# EAGLE design modul_atmega32 (EAGLE 7.7.0)
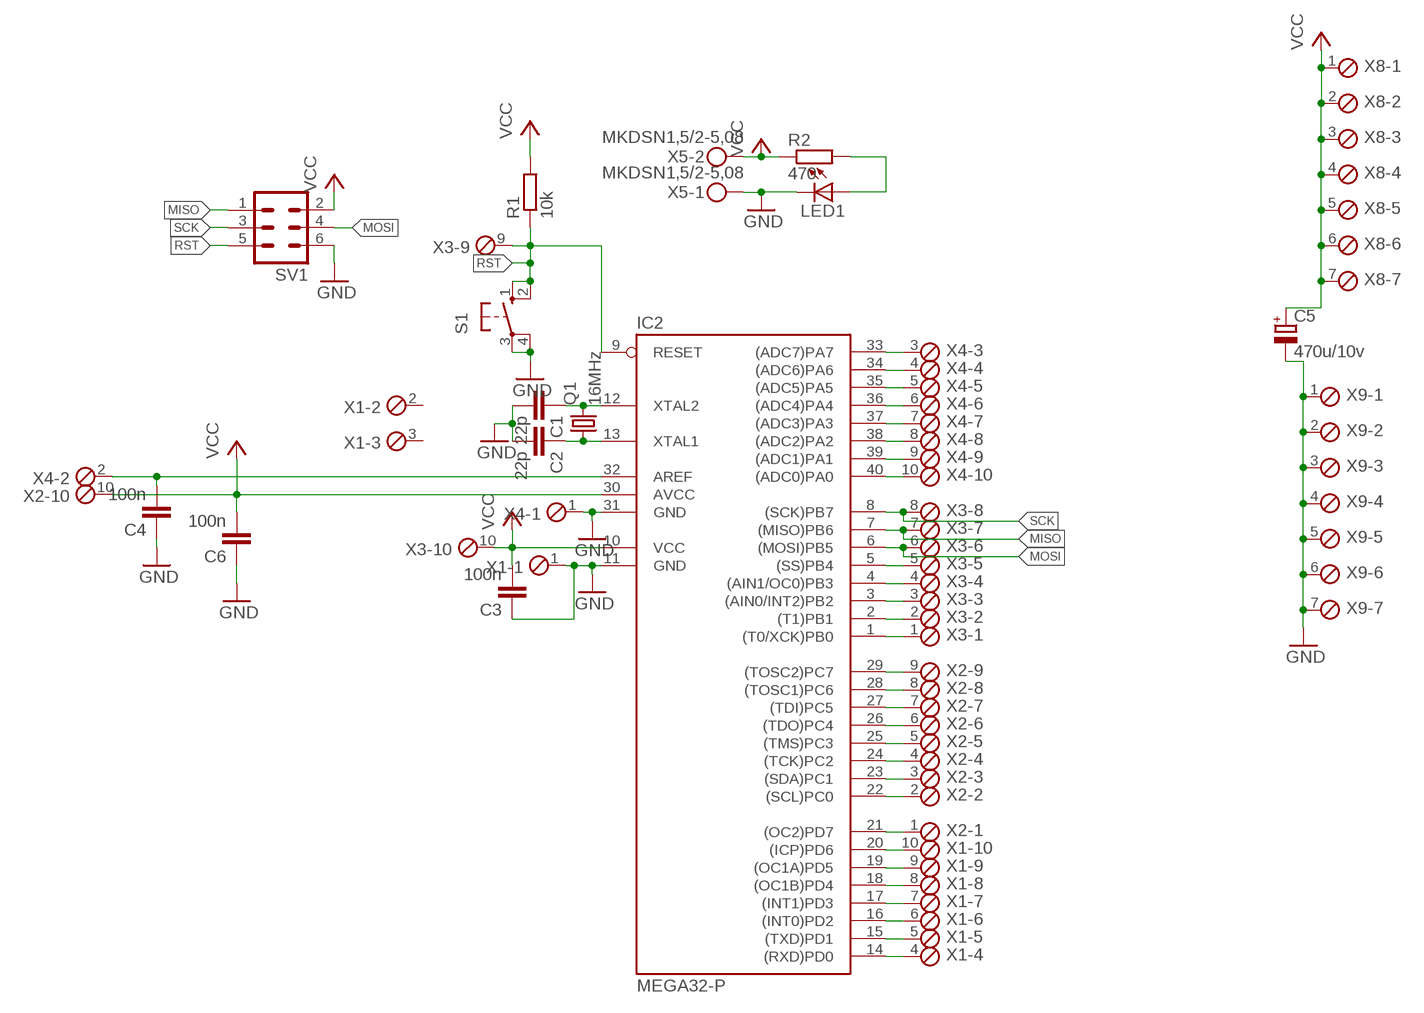
[diagram p0: schematic, sheet 1]

## Parts
C1  22p  C-EUC0805K  [C0805K]
C2  22p  C-EUC0805K  [C0805K]
C3  100n  C-EUC1206  [C1206]
C4  100n  C-EUC1206  [C1206]
C5  470u/10v  CPOL-EUE5-8.5  [E5-8,5]
C6  100n  C-EUC1206  [C1206]
IC2  MEGA32-P  [DIL40]
LED1  LED3MM  [LED3MM]
Q1  16MHz  CRYSTALHC49UP  [HC49UP]
R1  10k  R-EU_R1206  [R1206]
R2  470  R-EU_R1206  [R1206]
S1  10-XX  [B3F-10XX]
SV1  MA03-2  [MA03-2]
X1  MPT10  [10POL254]
X2  MPT10  [10POL254]
X3  MPT10  [10POL254]
X4  MPT10  [10POL254]
X5  MKDSN1,5/2-5,08  [MKDSN1,5/2-5,08]
X8  MPT7  [7POL254]
X9  MPT7  [7POL254]

## Nets
AREF: C4.2 IC2.32(AREF) X4.2
GND: C1.2 C2.2 C3.1 C4.1 C5.- C6.1 IC2.11(GND) IC2.31(GND) LED1.K(C) S1.3(P) S1.4(P1) SV1.6 X1.1 X4.1 X5.1 X9.1 X9.2 X9.3 X9.4 X9.5 X9.6 X9.7
MISO: IC2.7((MISO)PB6) SV1.1 X3.7
MOSI: IC2.6((MOSI)PB5) SV1.4 X3.6
N$1: IC2.21((OC2)PD7) X2.1
N$2: LED1.A R2.2
N$4: IC2.5((SS)PB4) X3.5
N$5: IC2.4((AIN1/OC0)PB3) X3.4
N$6: IC2.3((AIN0/INT2)PB2) X3.3
N$7: IC2.2((T1)PB1) X3.2
N$8: IC2.1((T0/XCK)PB0) X3.1
N$11: IC2.14((RXD)PD0) X1.4
N$12: IC2.15((TXD)PD1) X1.5
N$13: IC2.16((INT0)PD2) X1.6
N$14: IC2.17((INT1)PD3) X1.7
N$15: IC2.18((OC1B)PD4) X1.8
N$16: IC2.19((OC1A)PD5) X1.9
N$17: IC2.20((ICP)PD6) X1.10
N$19: C2.1 IC2.13(XTAL1) Q1.1
N$20: C1.1 IC2.12(XTAL2) Q1.2
N$22: IC2.29((TOSC2)PC7) X2.9
N$23: IC2.28((TOSC1)PC6) X2.8
N$24: IC2.27((TDI)PC5) X2.7
N$25: IC2.26((TDO)PC4) X2.6
N$26: IC2.25((TMS)PC3) X2.5
N$27: IC2.24((TCK)PC2) X2.4
N$28: IC2.23((SDA)PC1) X2.3
N$29: IC2.22((SCL)PC0) X2.2
N$32: IC2.33((ADC7)PA7) X4.3
N$33: IC2.34((ADC6)PA6) X4.4
N$34: IC2.35((ADC5)PA5) X4.5
N$35: IC2.36((ADC4)PA4) X4.6
N$36: IC2.37((ADC3)PA3) X4.7
N$37: IC2.38((ADC2)PA2) X4.8
N$38: IC2.39((ADC1)PA1) X4.9
N$39: IC2.40((ADC0)PA0) X4.10
RST: IC2.9(RESET) R1.1 S1.1(S) S1.2(S1) SV1.5 X3.9
SCK: IC2.8((SCK)PB7) SV1.3 X3.8
VCC: C3.2 C5.+ C6.2 IC2.10(VCC) IC2.30(AVCC) R1.2 R2.1 SV1.2 X2.10 X3.10 X5.2 X8.1 X8.2 X8.3 X8.4 X8.5 X8.6 X8.7
Unconnected: X1.2 X1.3

## Library data of the parts
C1-C4 C6 = rcl:C-EU: CAPACITOR, European symbol
C5 = rcl:CPOL-EU: POLARIZED CAPACITOR, European symbol
IC2 = atmel:MEGA32-P: MICROCONTROLLER 32 Kbytes FLASH 2 Kbytes SRAM 1 Kbytes EEPROM USART 8-channel 10 bit ADC Source: www.atmel.com .. doc2503.pdf; MPN: ATMEGA32-16PU; OC_FARNELL: 1661729; OC_NEWARK: 51P1794
LED1 = led:LED: LED OSRAM: - CHIPLED LG R971, LG N971, LY N971, LG Q971, LY Q971, LO R971, LY R971 LH N974, LH R974 LS Q976, LO Q976, LY Q976 LO Q996 - Hyper CHIPLED LW Q18S LB Q993, LB Q99A, LB R99A - SideLED LS A670, LO A670, LY A670, LG A670, LP A670 LB A673, LV A673, LT A673, LW A673 LH A674 LY A675 LS A676, LA A676, LO A676, LY A676, LW A676 LS A679, LY A679, LG A679 - Hyper Micro SIDELED® LS Y876, LA Y876, LO Y876, LY Y876 LT Y87S - SmartLED LW L88C, LW L88S LB L89C, LB L89S, LG L890 LS L89K, LO L89K, LY L89K LS L896, LA L896, LO L896, LY L896 - TOPLED LS T670, LO T670, LY T670, LG T670, LP T670 LSG T670, LSP T670, LSY T670, LOP T670, LYG T670 LG T671, LOG T671, LSG T671 LB T673, LV T673, LT T673, LW T673 LH T674 LS T676, LA T676, LO T676, LY T676, LB T676, LH T676, LSB T676, LW T676 LB T67C, LV T67C, LT T67C, LS T67K, LO T67K, LY T67K, LW E67C LS E67B, LA E67B, LO E67B, LY E67B, LB E67C, LV E67C, LT E67C LW T67C LS T679, LY T679, LG T679 LS T770, LO T770, LY T770, LG T770, LP T770 LB T773, LV T773, LT T773, LW T773 LH T774 LS E675, LA E675, LY E675, LS T675 LS T776, LA T776, LO T776, LY T776, LB T776 LHGB T686 LT T68C, LB T68C - Hyper Mini TOPLED® LB M676 - Mini TOPLED Santana® LG M470 LS M47K, LO M47K, LY M47K Source: http://www.osram.convergy.de LUXEON: - LUMILED® LXK2-PW12-R00, LXK2-PW12-S00, LXK2-PW14-U00, LXK2-PW14-V00 LXK2-PM12-R00, LXK2-PM12-S00, LXK2-PM14-U00 LXK2-PE12-Q00, LXK2-PE12-R00, LXK2-PE12-S00, LXK2-PE14-T00, LXK2-PE14-U00 LXK2-PB12-K00, LXK2-PB12-L00, LXK2-PB12-M00, LXK2-PB14-N00, LXK2-PB14-P00, LXK2-PB14-Q00 LXK2-PR12-L00, LXK2-PR12-M00, LXK2-PR14-Q00, LXK2-PR14-R00 LXK2-PD12-Q00, LXK2-PD12-R00, LXK2-PD12-S00 LXK2-PH12-R00, LXK2-PH12-S00 LXK2-PL12-P00, LXK2-PL12-Q00, LXK2-PL12-R00 Source: www.luxeon.com KINGBRIGHT: KA-3528ASYC Source: www.kingbright.com
Q1 = crystal:CRYSTAL: CRYSTAL; OC_FARNELL: unknown; OC_NEWARK: unknown
R1 R2 = rcl:R-EU_: RESISTOR, European symbol
S1 = switch-omron:10-XX: OMRON SWITCH; MPN: B3F-1000; OC_FARNELL: 176432; OC_NEWARK: 36M3542
SV1 = con-lstb:MA03-2: PIN HEADER; OC_FARNELL: unknown; OC_NEWARK: unknown
X1-X4 = con-phoenix-254:MPT10: PHOENIX CONNECTOR; OC_FARNELL: unknown; OC_NEWARK: unknown
X5 = con-phoenix-508:MKDSN1,5/2-5,08: MKDSN 1,5/ 2-5,08 Printklemme Nennstrom: 13,5 A Nennspannung: 250 V Rastermaß: 5,08 mm Polzahl: 2 Anschlussart: Schraubanschluss Montage: Löten Anschlussrichtung Leiter/Platine: 0 ° Artikelnummer: 1729128 Source: http://eshop.phoenixcontact.com .. 1729128.pdf
X8 X9 = con-phoenix-254:MPT7: PHOENIX CONNECTOR; OC_FARNELL: unknown; OC_NEWARK: unknown

## Board
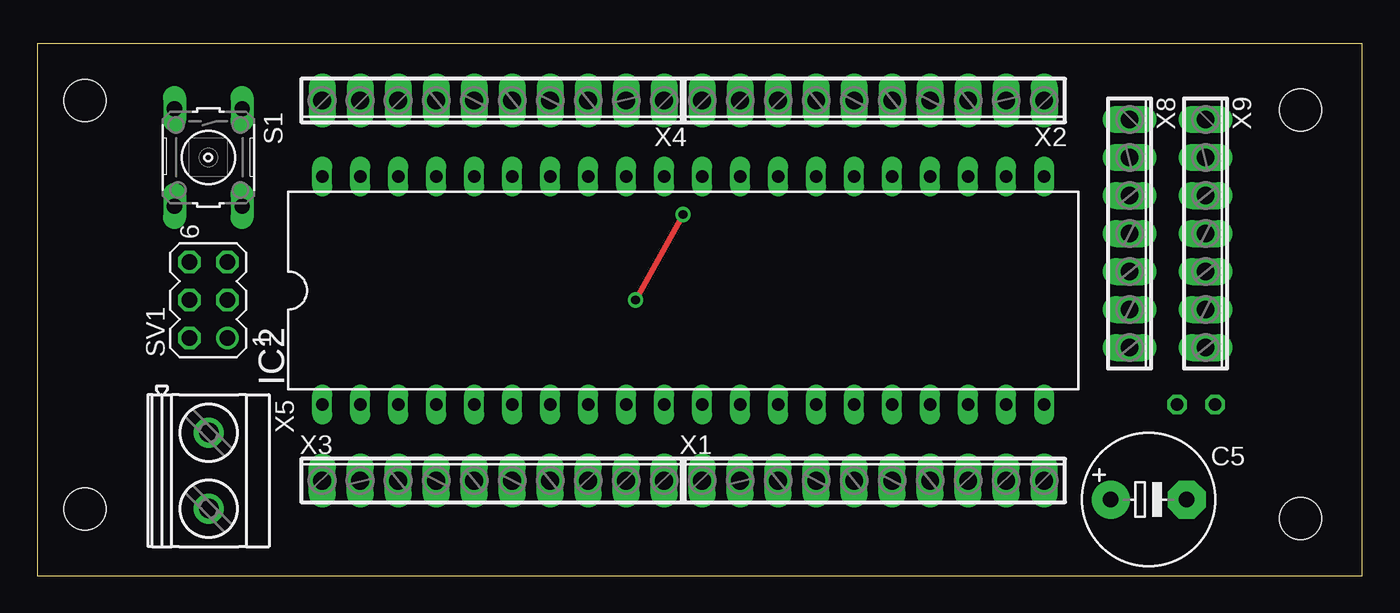
[diagram p1: board, top side]
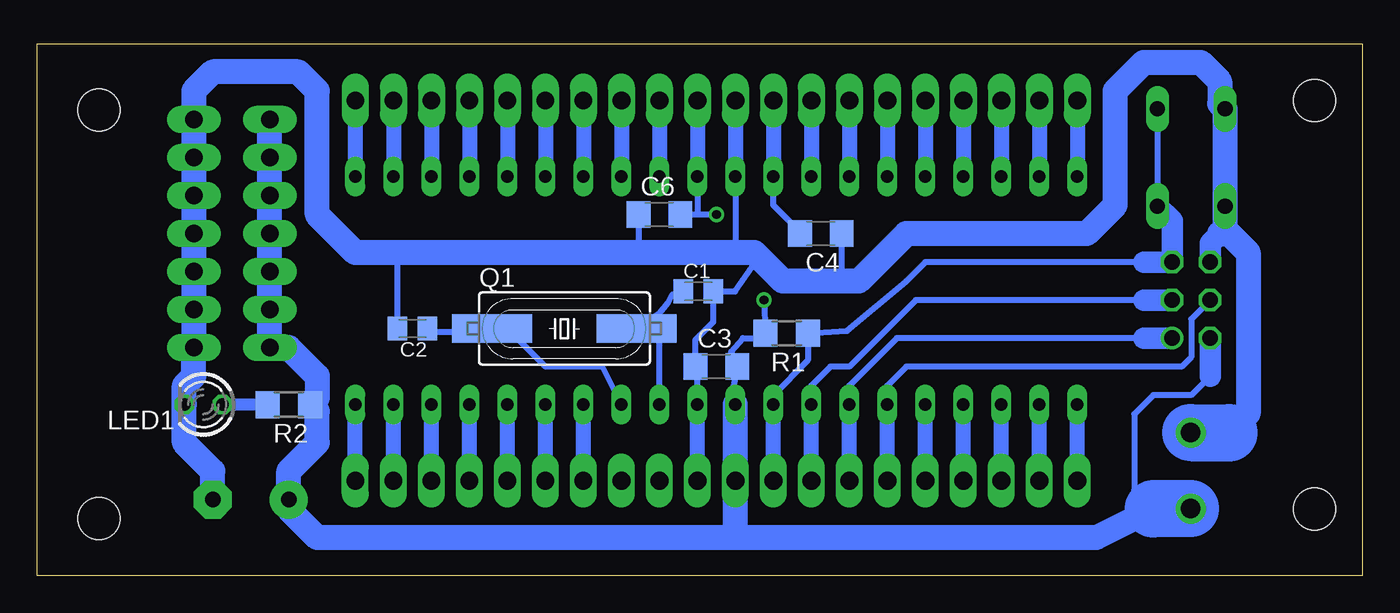
[diagram p2: board, bottom side, seen from below]

Size 88.57 x 35.55 mm. Coordinates in mm from the lower left corner, seen from the top.
Outline: 0,0 88.57,0 88.57,35.55 0,35.55 0,0
Copper layers (1*16): Top 0.035mm / dielectric 1.5mm / Bottom 0.035mm
Design rules "default": minimum track width 10mil, minimum drill 24mil, track to track 8mil, track to pad 8mil, pad to pad 8mil, via to via 8mil, smd to smd 8mil, copper to edge 40mil, drill to drill 8mil, minimum pad ring 10mil, minimum via ring 8mil, stop-mask expansion 4mil, vias tented up to drill 0mil, thermal gap 10mil
Holes 2.8 mm at 3.17,31.75 3.17,4.45 84.45,31.11 84.45,3.81

### Footprints (pad centres in the part's own frame; a part is rotated, then mirrored left to right if it is on the bottom)
C0805K = smd 1.3 x 1.6: 1 -1,0; 2 1,0
C1206 = smd 1.6 x 1.8: 1 -1.4,0; 2 1.4,0
E5-8,5 = drill 1.016 pad 2.54: + -2.54,0 | drill 1.016 pad 2.54 octagon: - 2.54,0
DIL40 = drill 0.813 long: 1 -24.13,-7.62; 2 -21.59,-7.62; 3 -19.05,-7.62; 4 -16.51,-7.62; 5 -13.97,-7.62; 6 -11.43,-7.62; 7 -8.89,-7.62; 8 -6.35,-7.62; 9 -3.81,-7.62; 10 -1.27,-7.62; 11 1.27,-7.62; 12 3.81,-7.62; 13 6.35,-7.62; 14 8.89,-7.62; 15 11.43,-7.62; 16 13.97,-7.62; 17 16.51,-7.62; 18 19.05,-7.62; 19 21.59,-7.62; 20 24.13,-7.62; 21 24.13,7.62; 22 21.59,7.62; 23 19.05,7.62; 24 16.51,7.62; 25 13.97,7.62; 26 11.43,7.62; 27 8.89,7.62; 28 6.35,7.62; 29 3.81,7.62; 30 1.27,7.62; 31 -1.27,7.62; 32 -3.81,7.62; 33 -6.35,7.62; 34 -8.89,7.62; 35 -11.43,7.62; 36 -13.97,7.62; 37 -16.51,7.62; 38 -19.05,7.62; 39 -21.59,7.62; 40 -24.13,7.62
LED3MM = drill 0.813 octagon: A -1.27,0; K 1.27,0
HC49UP = smd 5.334 x 1.93: 1 -4.826,0; 2 4.826,0
R1206 = smd 1.6 x 1.803: 1 -1.422,0; 2 1.422,0
B3F-10XX = drill 1.016 long: 1 -3.251,2.261; 2 3.251,2.261; 3 -3.251,-2.261; 4 3.251,-2.261
MA03-2 = drill 1.016: 1 -2.54,-1.27 | drill 1.016 octagon: 2 -2.54,1.27; 3 0,-1.27; 4 0,1.27; 5 2.54,-1.27; 6 2.54,1.27
10POL254 = drill 1.2 long: 1 -11.43,0; 2 -8.89,0; 3 -6.35,0; 4 -3.81,0; 5 -1.27,0; 6 1.27,0; 7 3.81,0; 8 6.35,0; 9 8.89,0; 10 11.43,0
MKDSN1,5/2-5,08 = drill 1.3 pad 2: 1 -2.561,0.025; 2 2.519,0.025
7POL254 = drill 1.2 long: 1 -7.62,0; 2 -5.08,0; 3 -2.54,0; 4 0,0; 5 2.54,0; 6 5.08,0; 7 7.62,0

### Placement (x,y rotation side)
C1  44.39,18.99 0 bottom
C2  63.5,16.51 180 bottom
C3  43.18,13.97 0 bottom
C4  36.2,22.86 180 bottom
C5  74.3,5.08 0 top
C6  46.99,24.13 0 bottom
IC2  43.18,19.05 0 top
LED1  77.47,11.43 180 bottom
Q1  53.34,16.51 0 bottom
R1  38.48,16.19 180 bottom
R2  71.75,11.43 180 bottom
S1  11.43,27.94 270 top
SV1  11.43,18.41 90 top
X1  55.88,6.35 0 top
X2  55.88,31.75 180 top
X3  30.48,6.35 0 top
X4  30.48,31.75 180 top
X5  11.43,6.99 270 top
X8  73.03,22.86 270 top
X9  78.11,22.86 270 top

### Tracks (layer width: path | path; a pad name or v marks a point on that pad's centre or on a via)
AREF
  Bottom 0.406: C4.2 38.1,22.86 38.1,23.5 39.37,24.77 IC2.32
  Bottom 1.016: X4.2 IC2.32
GND
  Bottom 0.406: IC2.11 44.45,13.7 C3.1 44.58,15.74 43.39,16.94 C1.2 | 43.18,19.41 C1.2 | C1.2 41.91,18.99 41.91,19.05 40.32,21.27 | C2.2 64.5,21.95 64.77,21.59 | IC2.31 41.91,21.59 | 46.72,21.95 46.35,21.59 | C4.1 34.8,19.82 34.92,19.68 | C6.1 48.39,21.72 48.26,21.59
  Bottom 0.813: 8.26,10.2 8.59,9.86 8.91,9.55
  Bottom 1.016: X4.1 IC2.31 | X1.1 IC2.11
  Bottom 1.422: SV1.6 10.16,22.23 9.53,22.86
  Bottom 1.676: 8.59,9.86 7.62,10.84 7.62,21.59 8.89,22.86 9.53,22.86 9.17,23.22 S1.4 S1.3 9.53,31.55 9.53,33.02 10.79,34.29 14.61,34.29 16.51,32.38 16.51,24.77 18.41,22.86 30.48,22.86 33.66,19.68 34.92,19.68 38.73,19.68 40.32,21.27 40.64,21.59 41.91,21.59 46.35,21.59 48.26,21.59 64.77,21.59 67.31,21.59 69.85,24.13 69.85,32.38 71.12,33.66 76.83,33.66 78.11,32.38 X9.1 X9.2 X9.3 X9.4 X9.5 X9.6 X9.7 78.11,13.34 78.74,12.7 LED1.K 78.74,8.89 76.83,6.99 C5.-
  Bottom 3.81: X5.1 8.91,9.55 8.89,9.53
MISO
  Bottom 0.406: IC2.7 34.29,12.7 31.11,15.88 14.61,15.88
  Bottom 1.016: X3.7 IC2.7
  Bottom 1.422: SV1.1 14.61,15.88
MOSI
  Bottom 0.406: SV1.4 11.43,17.14 11.43,14.61 12.06,13.97 30.48,13.97 31.75,12.7 IC2.6
  Bottom 1.016: X3.6 IC2.6
N$1
  Bottom 1.016: X2.1 IC2.21
N$2
  Bottom 0.813: R2.2 LED1.A
N$4
  Bottom 1.016: X3.5 IC2.5
N$5
  Bottom 1.016: X3.4 IC2.4
N$6
  Bottom 1.016: X3.3 IC2.3
N$7
  Bottom 1.016: X3.2 IC2.2
N$8
  Bottom 1.016: X3.1 IC2.1
N$11
  Bottom 1.016: X1.4 IC2.14
N$12
  Bottom 1.016: X1.5 IC2.15
N$13
  Bottom 1.016: X1.6 IC2.16
N$14
  Bottom 1.016: X1.7 IC2.17
N$15
  Bottom 1.016: X1.8 IC2.18
N$16
  Bottom 1.016: X1.9 IC2.19
N$17
  Bottom 1.016: X1.10 IC2.20
N$19
  Bottom 0.406: IC2.13 50.8,13.97 54.61,13.97 57.15,16.51 57.15,16.26 | 57.15,16.26 Q1.1 | 57.15,16.26 62.25,16.26 C2.1
N$20
  Bottom 0.406: IC2.12 46.99,17.53 | 46.99,17.53 Q1.2 | 46.99,17.53 46.42,18.22 46.1,18.8 C1.1
N$22
  Bottom 1.016: X2.9 IC2.29
N$23
  Bottom 1.016: X2.8 IC2.28
N$24
  Bottom 1.016: X2.7 IC2.27
N$25
  Bottom 1.016: X2.6 IC2.26
N$26
  Bottom 1.016: X2.5 IC2.25
N$27
  Bottom 1.016: X2.4 IC2.24
N$28
  Bottom 1.016: X2.3 IC2.23
N$29
  Bottom 1.016: X2.2 IC2.22
N$32
  Bottom 1.016: X4.3 IC2.33
N$33
  Bottom 1.016: X4.4 IC2.34
N$34
  Bottom 1.016: X4.5 IC2.35
N$35
  Bottom 1.016: X4.6 IC2.36
N$36
  Bottom 1.016: X4.7 IC2.37
N$37
  Bottom 1.016: X4.8 IC2.38
N$38
  Bottom 1.016: X4.9 IC2.39
N$39
  Bottom 1.016: X4.10 IC2.40
RST
  Bottom 0.406: S1.1 S1.2 | 14.61,20.95 29.21,20.95 30.48,19.68 34.44,16.36 R1.1 37.06,14.38 39.37,12.06 IC2.9
  Bottom 1.016: X3.9 IC2.9
  Bottom 1.422: S1.2 12.7,23.7 SV1.5 14.61,20.95
SCK
  Bottom 0.406: IC2.8 36.83,12.7 35.56,13.97 34.29,13.97 29.84,18.41 14.61,18.41
  Bottom 1.016: X3.8 IC2.8
  Bottom 1.422: SV1.3 14.61,18.41
VCC  (via drill 0.6)
  Top 0.406: v43.18,24.13 v40.01,18.41
  Bottom 0.406: 10.16,13.34 11.43,12.06 13.97,12.06 15.24,10.79 15.24,5.71 13.97,4.45 | IC2.10 42.18,11.7 C3.2 42.18,14.97 41.4,15.88 40.28,15.88 R1.2 v40.01,18.41 | v43.18,24.13 44.45,24.13 | 44.45,24.13 C6.2 | IC2.30 44.45,24.13
  Bottom 1.016: X2.10 IC2.30
  Bottom 1.422: SV1.2 10.16,13.34
  Bottom 1.676: 13.97,4.45 17.78,2.54 41.91,2.54 | 41.91,2.54 X3.10 IC2.10 | 41.91,2.54 69.85,2.54 71.75,4.45 C5.+ 71.75,6.99 69.85,8.89 69.85,10.95 R2.1 69.85,11.91 69.85,13.34 71.75,15.24 X8.7 X8.6 X8.5 X8.4 X8.3 X8.2 X8.1
  Bottom 3.81: X5.2 13.95,4.47 13.97,4.45